# EAGLE design Ilumitunes-IR-String-Controller-v10 (EAGLE 6.1)
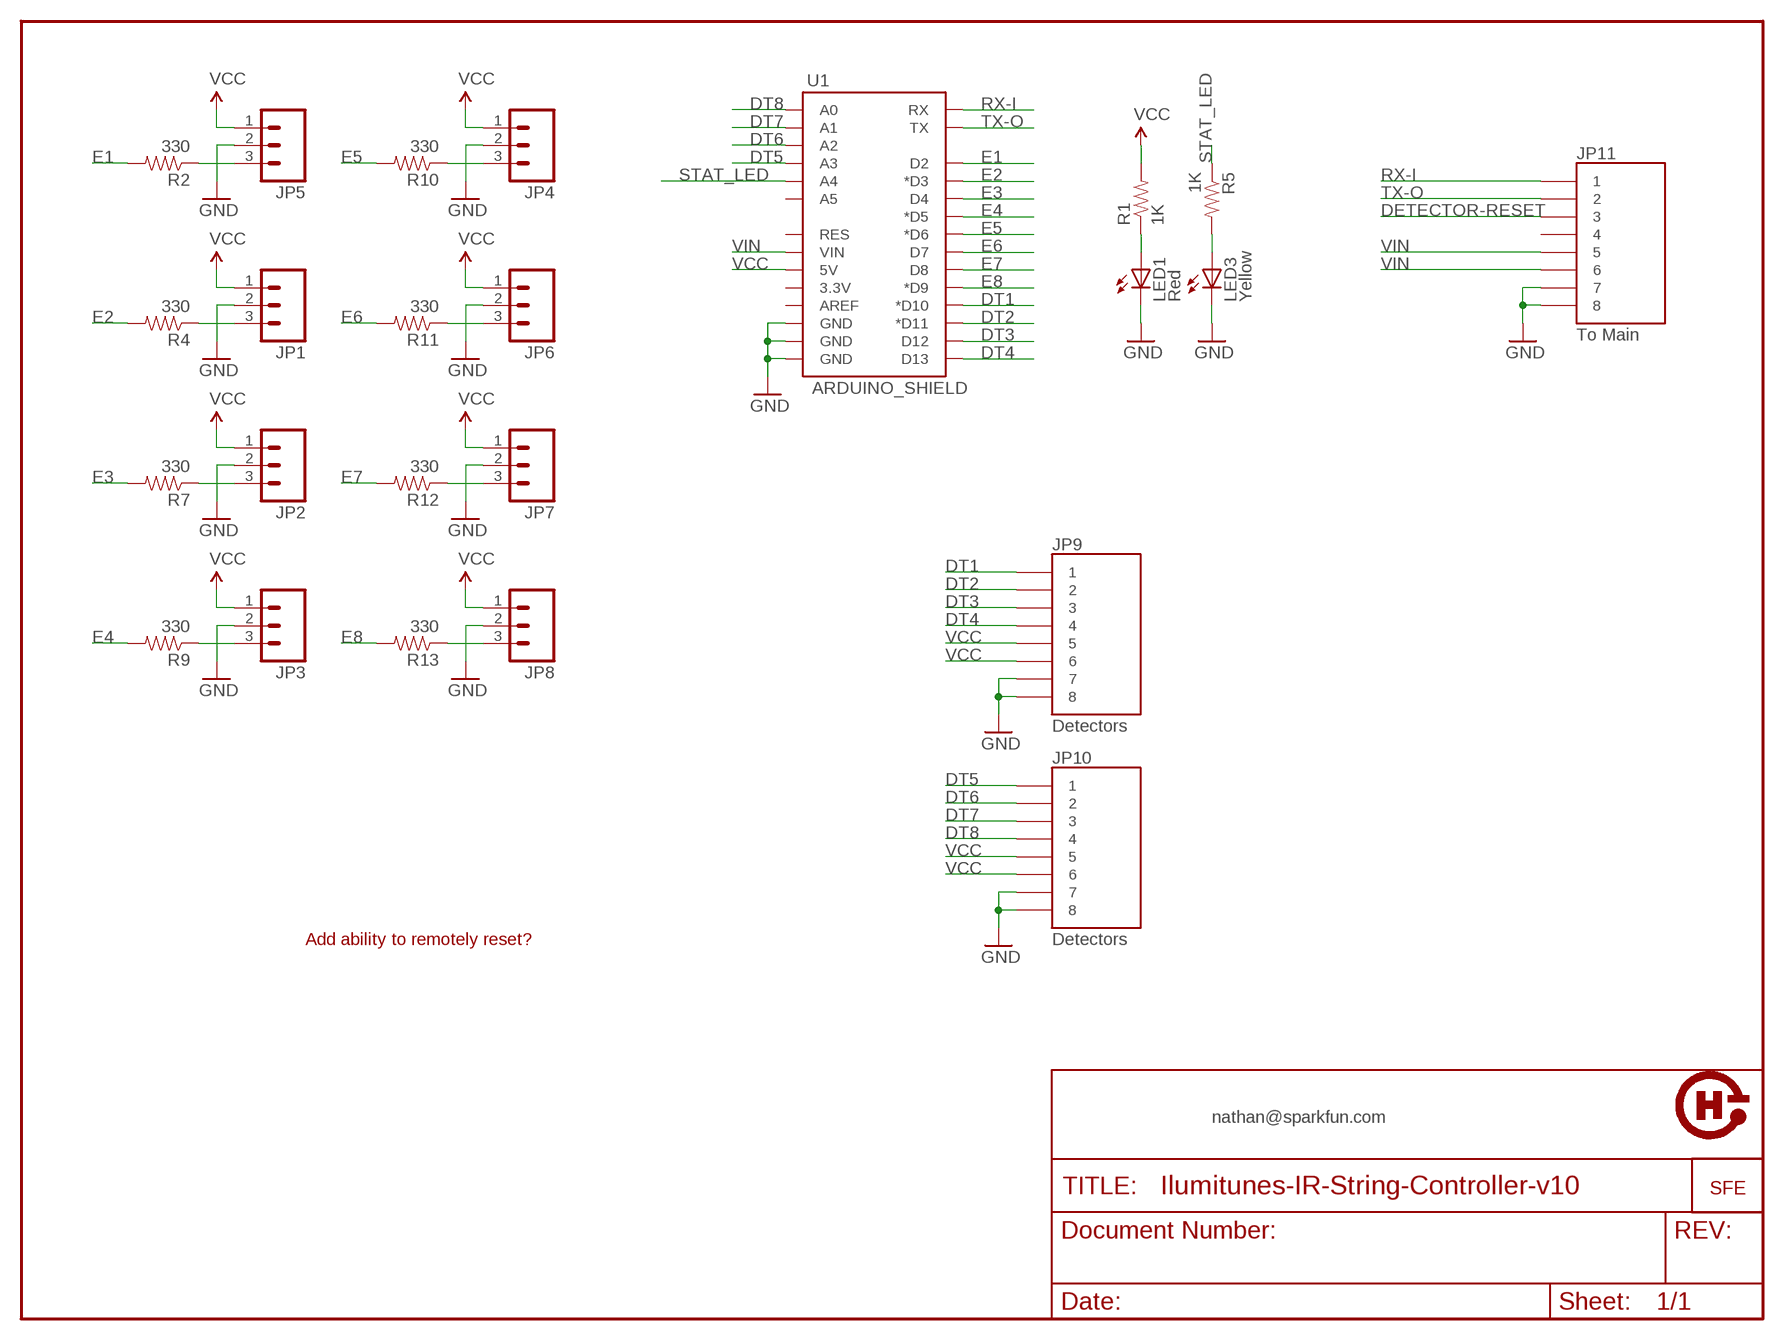
[diagram p0: schematic, sheet 1]

## Parts
JP1  M03JST-PTH-VERT  [JST-3-PTH-VERT]
JP2  M03JST-PTH-VERT  [JST-3-PTH-VERT]
JP3  M03JST-PTH-VERT  [JST-3-PTH-VERT]
JP4  M03JST-PTH-VERT  [JST-3-PTH-VERT]
JP5  M03JST-PTH-VERT  [JST-3-PTH-VERT]
JP6  M03JST-PTH-VERT  [JST-3-PTH-VERT]
JP7  M03JST-PTH-VERT  [JST-3-PTH-VERT]
JP8  M03JST-PTH-VERT  [JST-3-PTH-VERT]
JP9  Detectors  RJ45-8PTH  [RJ45-8]
JP10  Detectors  RJ45-8PTH  [RJ45-8]
JP11  To Main  RJ45-8PTH  [RJ45-8]
LED1  Red  LED5MM  [LED5MM]
LED3  Yellow  LED5MM  [LED5MM]
R1  1K  RESISTORAXIAL-0.3  [AXIAL-0.3]
R2  330  RESISTORAXIAL-0.3  [AXIAL-0.3]
R4  330  RESISTORAXIAL-0.3  [AXIAL-0.3]
R5  1K  RESISTORAXIAL-0.3  [AXIAL-0.3]
R7  330  RESISTORAXIAL-0.3  [AXIAL-0.3]
R9  330  RESISTORAXIAL-0.3  [AXIAL-0.3]
R10  330  RESISTORAXIAL-0.3  [AXIAL-0.3]
R11  330  RESISTORAXIAL-0.3  [AXIAL-0.3]
R12  330  RESISTORAXIAL-0.3  [AXIAL-0.3]
R13  330  RESISTORAXIAL-0.3  [AXIAL-0.3]
U1  ARDUINO_SHIELD  ARDUINO_SHIELDLABEL  [DUEMILANOVE_SHIELD]
U$1  LOGO-SFENEW  [SFE-NEW-WEBLOGO]
U$2  OSHW-LOGO  [OSHW-LOGO]

## Nets
DETECTOR-RESET: JP11.3
DT1: JP9.1 U1.D10(*D10)
DT2: JP9.2 U1.D11(*D11)
DT3: JP9.3 U1.D12
DT4: JP9.4 U1.D13
DT5: JP10.1 U1.A3
DT6: JP10.2 U1.A2
DT7: JP10.3 U1.A1
DT8: JP10.4 U1.A0
E1: R2.P$2 U1.D2
E2: R4.P$2 U1.D3(*D3)
E3: R7.P$2 U1.D4
E4: R9.P$2 U1.D5(*D5)
E5: R10.P$2 U1.D6(*D6)
E6: R11.P$2 U1.D7
E7: R12.P$2 U1.D8
E8: R13.P$2 U1.D9(*D9)
GND: JP1.2 JP2.2 JP3.2 JP4.2 JP5.2 JP6.2 JP7.2 JP8.2 JP9.7 JP9.8 JP10.7 JP10.8 JP11.7 JP11.8 LED1.K(C) LED3.K(C) U1.GND@0(GND) U1.GND@1(GND) U1.GND@2(GND)
N$1: LED1.A R1.P$1
N$2: JP5.3 R2.P$1
N$4: LED3.A R5.P$2
N$6: JP1.3 R4.P$1
N$9: JP2.3 R7.P$1
N$12: JP3.3 R9.P$1
N$13: JP4.3 R10.P$1
N$14: JP6.3 R11.P$1
N$15: JP7.3 R12.P$1
N$16: JP8.3 R13.P$1
RX-I: JP11.1 U1.RX
STAT_LED: R5.P$1 U1.A4
TX-O: JP11.2 U1.TX
VCC [vcc]: JP1.1 JP2.1 JP3.1 JP4.1 JP5.1 JP6.1 JP7.1 JP8.1 JP9.5 JP9.6 JP10.5 JP10.6 R1.P$2 U1.5V
VIN: JP11.5 JP11.6 U1.VIN
Unconnected: JP11.4 U1.3.3V U1.A5 U1.AREF U1.RES

## Notes on the sheet
- Add ability to remotely reset?
- nathan@sparkfun.com

## Library data of the parts
JP1-JP8 = SparkFun:M03: Header 3 Standard 3-pin 0.1" header. Use with straight break away headers (SKU : PRT-00116), right angle break away headers (PRT-00553), swiss pins (PRT-00743), machine pins (PRT-00117), and female headers (PRT-00115). Molex polarized connector foot print use with SKU : PRT-08232 with associated crimp pins and housings.
JP9-JP11 = SparkFun:RJ45-8: RJ45 Jack Simple RJ45, 8-pin connection - connector for common Cat5, Cat5e, and Cat6 Ethernet cables. Footprint not yet proven in production. Connector sku is PRT-00643; Breakout PCB sku is BOB-00716.
LED1 LED3 = SparkFun:LED: LEDs Standard schematic elements and footprints for 5mm, 3mm, 1206, and 0603 sized LEDs. 5mm - Spark Fun Electronics SKU : COM-00529 (and others)
R1 R2 R4 R5 R7 R9-R13 = SparkFun:RESISTOR: Resistor Basic schematic elements and footprints for 0603, 1206, and PTH resistors.
U1 = SparkFun:ARDUINO_SHIELD
U$1 = SparkFun:LOGO-SFE: Spark Fun Electronics PCB Logo This is the standard Spark Fun Electronics PCB logo.
U$2 = SparkFun:OSHW-LOGO: Open Source Hardware Logo This logo indicates the piece of hardware it is found on incorporates a OSHW license and/or adheres to the definition of open source hardware found here: http://freedomdefined.org/OSHW

## Net classes
1 vcc: width 0.508 mm

## Board
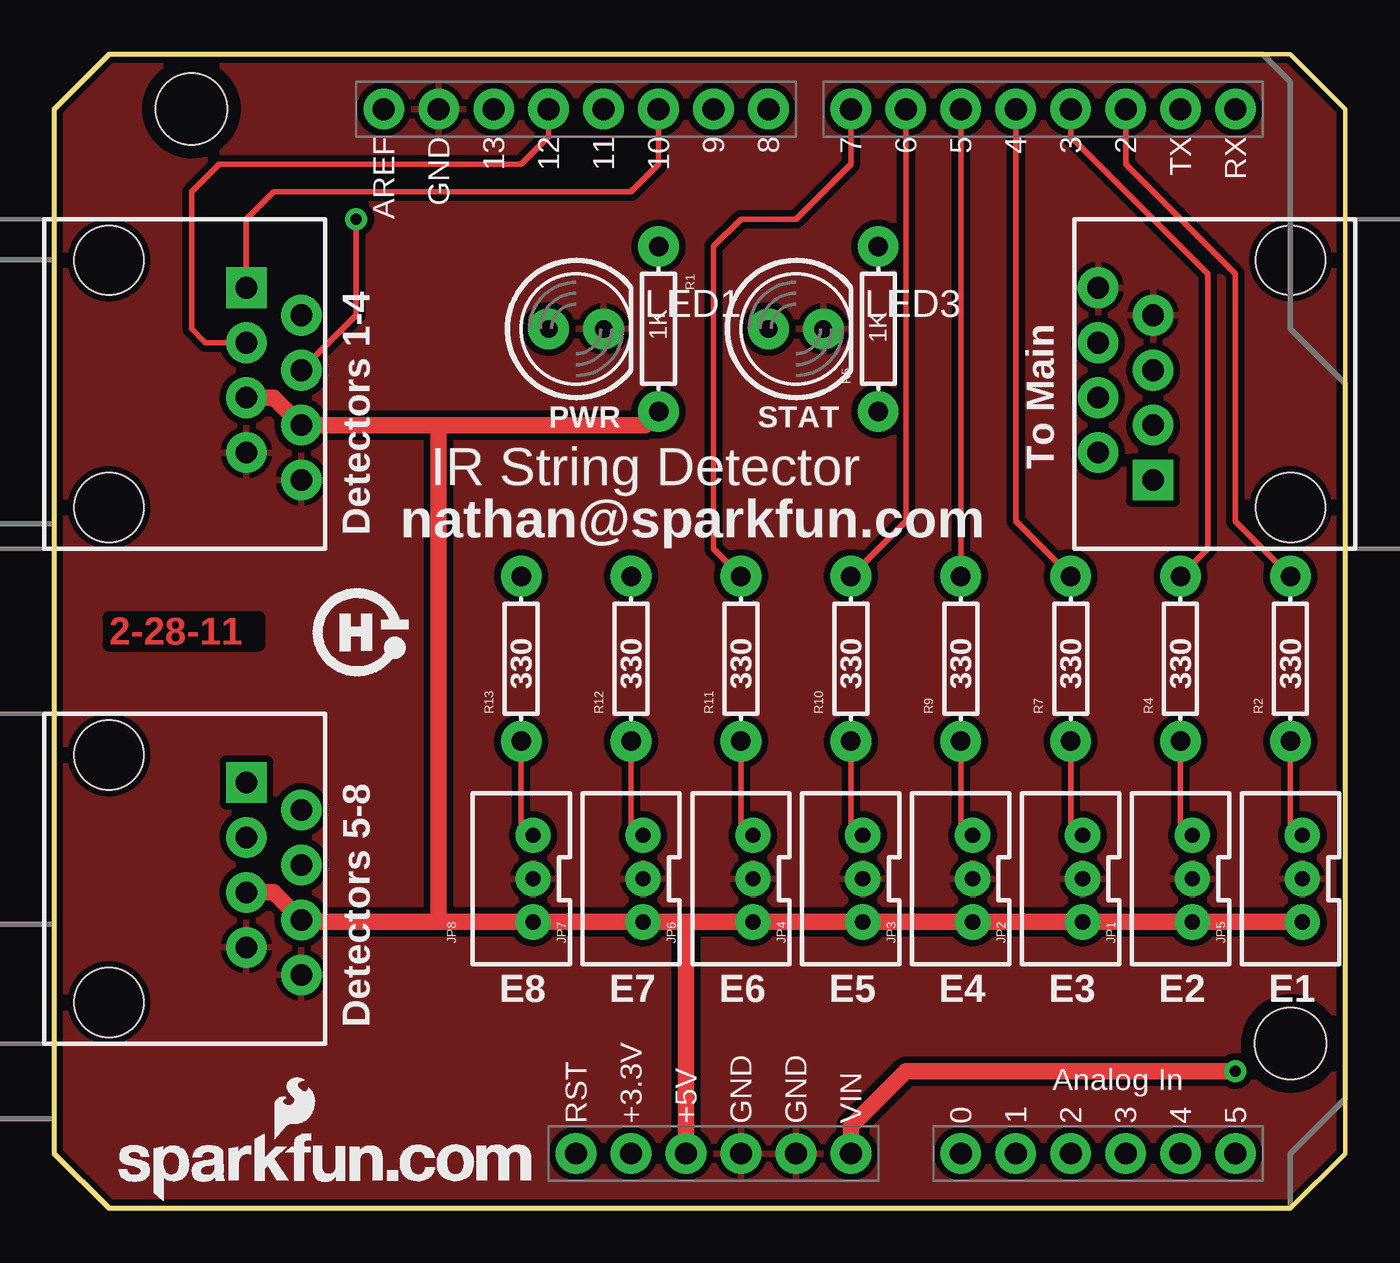
[diagram p1: board, top side]
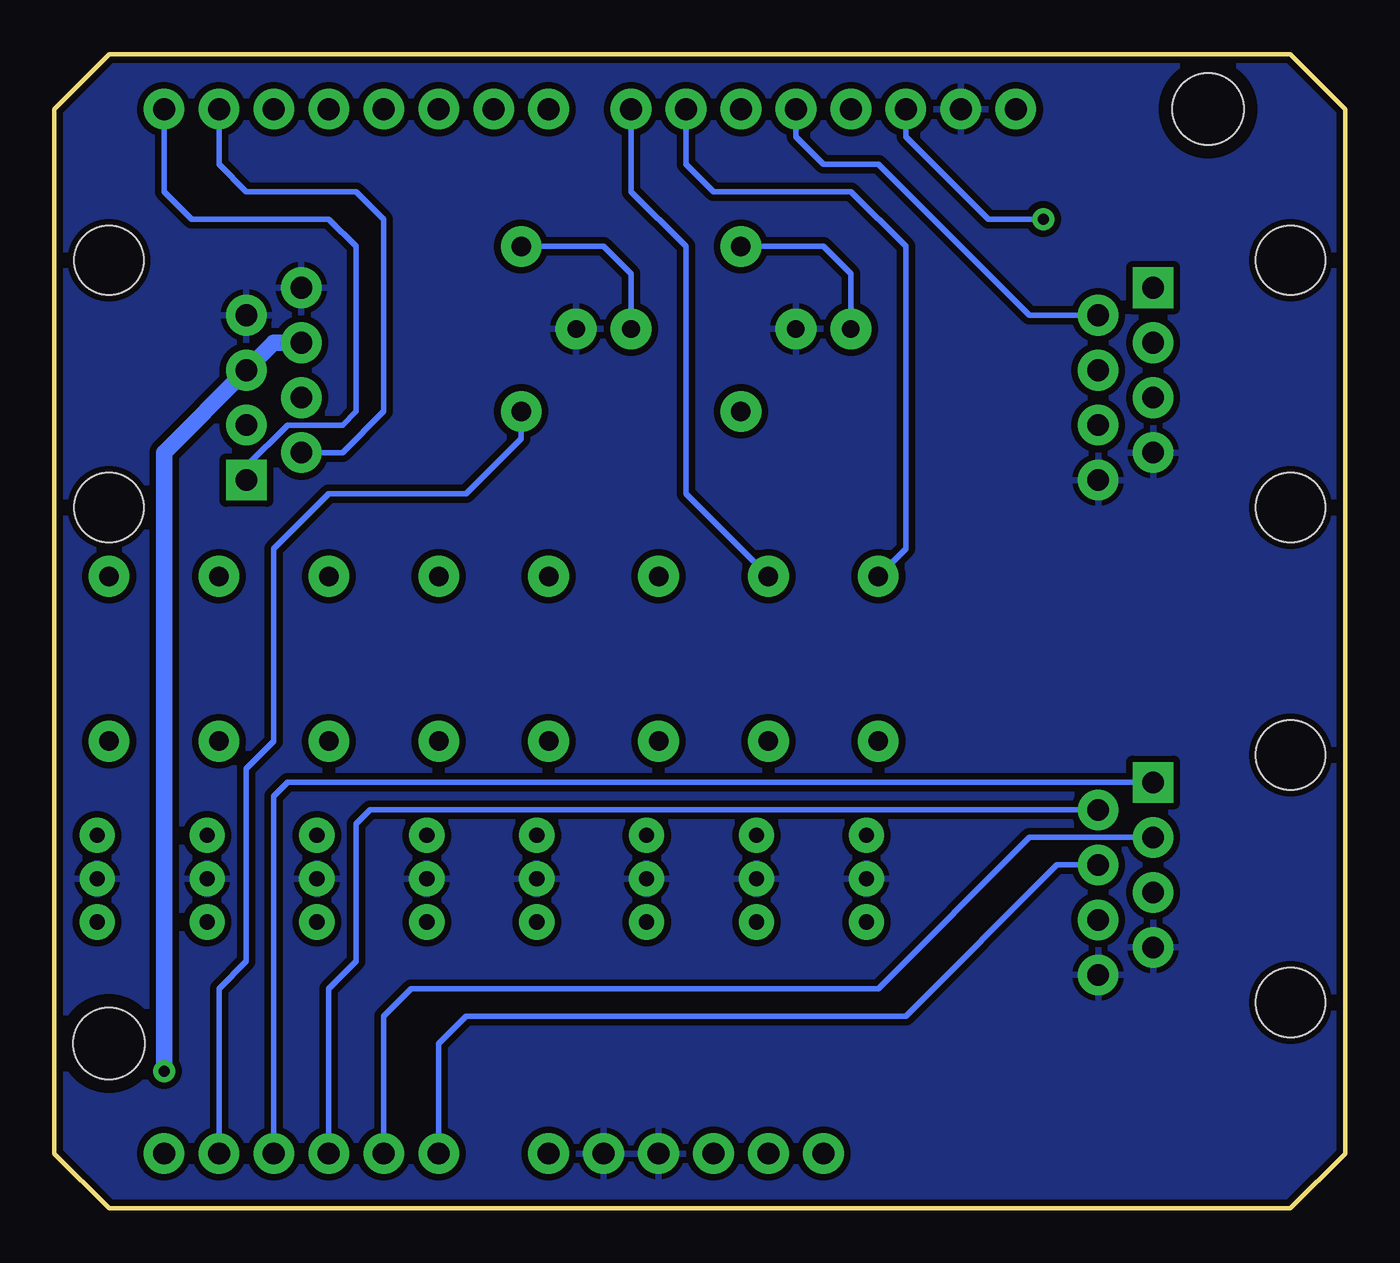
[diagram p2: board, bottom side, seen from below]

Size 59.69 x 53.34 mm. Coordinates in mm from the lower left corner, seen from the top.
Outline: 2.54,0 57.15,0 59.69,2.54 59.69,50.8 57.15,53.34 2.54,53.34 0,50.8 0,2.54 2.54,0
Copper layers (1*16): Top 0.035mm / dielectric 1.5mm / Bottom 0.035mm
Design rules: minimum track width 10mil, minimum drill 20mil, track to track 8mil, track to pad 8mil, pad to pad 8mil, via to via 8mil, smd to smd 8mil, copper to edge 10mil, drill to drill 8mil, minimum pad ring 12mil, minimum via ring 10mil, stop-mask expansion 4mil, vias tented up to drill 25mil, thermal gap 10mil

### Footprints (pad centres in the part's own frame; a part is rotated, then mirrored left to right if it is on the bottom)
JST-3-PTH-VERT = drill 0.7 pad 1.626: 1 -2,-0.55; 2 0,-0.55; 3 2,-0.55
RJ45-8 = drill 1 pad 1.88 square: 1 -4.445,6.35 | drill 1 pad 1.88: 2 -3.175,8.89; 3 -1.905,6.35; 4 -0.635,8.89; 5 0.635,6.35; 6 1.905,8.89; 7 3.175,6.35; 8 4.445,8.89 | hole 3.2: -5.715,0; 5.715,0
LED5MM = drill 0.813 pad 1.88: A -1.27,0; K 1.27,0
AXIAL-0.3 = drill 0.9 pad 1.88: P$1 -3.81,0; P$2 3.81,0
DUEMILANOVE_SHIELD = drill 1.016 pad 1.88: 3.3V 50.8,26.67; 5V 50.8,29.21; A0 50.8,41.91; A1 50.8,44.45; A2 50.8,46.99; A3 50.8,49.53; A4 50.8,52.07; A5 50.8,54.61; AREF 2.54,15.24; D2 2.54,49.53; D3 2.54,46.99; D4 2.54,44.45; D5 2.54,41.91; D6 2.54,39.37; D7 2.54,36.83; D8 2.54,33.02; D9 2.54,30.48; D10 2.54,27.94; D11 2.54,25.4; D12 2.54,22.86; D13 2.54,20.32; GND@0 50.8,31.75; GND@1 50.8,34.29; GND@2 2.54,17.78; RES 50.8,24.13; RX 2.54,54.61; TX 2.54,52.07; VIN 50.8,36.83 | hole 3.302: 45.72,57.15; 2.54,6.35

### Placement (x,y rotation side)
JP1  52.07,15.24 90 top
JP2  46.99,15.24 90 top
JP3  41.91,15.24 90 top
JP4  36.83,15.24 90 top
JP5  57.15,15.24 90 top
JP6  31.75,15.24 90 top
JP7  26.67,15.24 90 top
JP8  21.59,15.24 90 top
JP9  2.54,38.1 270 top
JP10  2.54,15.24 270 top
JP11  57.15,38.1 90 top
LED1  24.13,40.64 0 top
LED3  34.29,40.64 0 top
R1  27.94,40.64 270 top
R2  57.15,25.4 90 top
R4  52.07,25.4 90 top
R5  38.1,40.64 90 top
R7  46.99,25.4 90 top
R9  41.91,25.4 90 top
R10  36.83,25.4 90 top
R11  31.75,25.4 90 top
R12  26.67,25.4 90 top
R13  21.59,25.4 90 top
U1  0,53.34 270 top
U$1  2.98,0.34 0 top
U$2  13.97,26.67 0 top

### Tracks (layer width: path | path; a pad name or v marks a point on that pad's centre or on a via)
DT1
  Top 0.254: JP9.1 8.89,45.72 10.16,46.99 26.67,46.99 27.94,48.26 U1.D10
DT2
  Bottom 0.254: JP9.2 14.61,41.27 21.59,48.26 24.13,48.26 25.4,49.53 U1.D11
DT3
  Top 0.254: JP9.3 6.99,40.01 6.35,40.64 6.35,46.99 7.62,48.26 21.59,48.26 22.86,49.53 U1.D12
DT4  (via drill 0.51)
  Top 0.254: v13.97,45.72 13.97,41.27 JP9.4
  Bottom 0.254: U1.D13 20.32,49.53 16.51,45.72 v13.97,45.72
DT5
  Bottom 0.254: JP10.1 48.9,19.68 49.53,19.05 U1.A3
DT6
  Bottom 0.254: JP10.2 45.09,18.41 45.72,17.78 45.72,11.43 46.99,10.16 U1.A2
DT7
  Bottom 0.254: JP10.3 14.61,17.14 21.59,10.16 43.18,10.16 44.45,8.89 U1.A1
DT8
  Bottom 0.254: JP10.4 13.34,15.88 20.32,8.89 40.64,8.89 41.91,7.62 U1.A0
E1
  Top 0.254: U1.D2 49.53,48.26 54.61,43.18 54.61,31.75 R2.P$2
E2
  Top 0.254: U1.D3 46.99,49.53 53.34,43.18 53.34,30.48 R4.P$2
E3
  Top 0.254: U1.D4 44.45,31.75 R7.P$2
E4
  Top 0.254: R9.P$2 U1.D5
E5
  Top 0.254: U1.D6 39.37,31.75 R10.P$2
E6
  Top 0.254: U1.D7 36.83,48.26 34.29,45.72 31.75,45.72 30.48,44.45 30.48,30.48 R11.P$2
E7
  Bottom 0.254: U1.D8 33.02,46.99 30.48,44.45 30.48,33.02 R12.P$2
E8
  Bottom 0.254: U1.D9 30.48,48.26 29.21,46.99 22.86,46.99 20.32,44.45 20.32,30.48 R13.P$2
GND
  pour Top (isolate 0.305): 0,0 0,53.34 59.69,53.34 59.69,0
  pour Bottom (isolate 0.305): 0,0 0,53.34 59.69,53.34 59.69,0
N$1
  Bottom 0.254: LED1.A 22.86,43.18 24.13,44.45 R1.P$1
N$2
  Top 0.254: R2.P$1 57.15,17.79 JP5.3
N$4
  Bottom 0.254: R5.P$2 34.29,44.45 33.02,43.18 LED3.A
N$6
  Top 0.254: R4.P$1 52.07,17.79 JP1.3
N$9
  Top 0.254: R7.P$1 46.99,17.79 JP2.3
N$12
  Top 0.254: R9.P$1 41.91,17.79 JP3.3
N$13
  Top 0.254: R10.P$1 36.83,17.79 JP4.3
N$14
  Top 0.254: R11.P$1 31.75,17.79 JP6.3
N$15
  Top 0.254: R12.P$1 26.67,17.79 JP7.3
N$16
  Top 0.254: R13.P$1 21.59,17.79 JP8.3
RX-I
  Bottom 0.254: U1.RX 54.61,46.99 53.34,45.72 46.99,45.72 45.72,44.45 45.72,36.83 46.35,36.2 48.9,36.2 50.8,34.29 JP11.1
STAT_LED
  Bottom 0.254: U1.A4 52.07,10.16 50.8,11.43 50.8,20.32 49.53,21.59 49.53,30.48 46.99,33.02 40.64,33.02 38.1,35.56 R5.P$1
TX-O
  Bottom 0.254: U1.TX 52.07,48.26 50.8,46.99 45.72,46.99 44.45,45.72 44.45,36.83 46.35,34.92 JP11.2
VCC
  Top 0.762: JP5.1 JP1.1 JP2.1 JP3.1 JP4.1 JP6.1 29.21,13.24 | 29.21,13.24 JP7.1 JP8.1 17.78,13.24 | 17.78,13.24 11.53,13.24 JP10.6 10.16,14.61 JP10.5 | R1.P$2 27.3,36.2 17.78,36.2 | JP9.5 10.16,37.47 JP9.6 17.78,36.2 | 17.78,13.24 17.78,36.2 | 29.21,13.24 U1.5V
VIN  (via drill 0.51)
  Top 0.762: U1.VIN 36.83,3.81 39.37,6.35 v54.61,6.35
  Bottom 0.762: v54.61,6.35 54.61,34.92 JP11.5 49.53,40.01 JP11.6

### Text on the board
Top: 2-28-11
tPlace: PWR | STAT | To Main | IR String Detector | Detectors 1-4 | nathan@sparkfun.com | E8 | E7 | E6 | E5 | E4 | E3 | E2 | E1 | Detectors 5-8